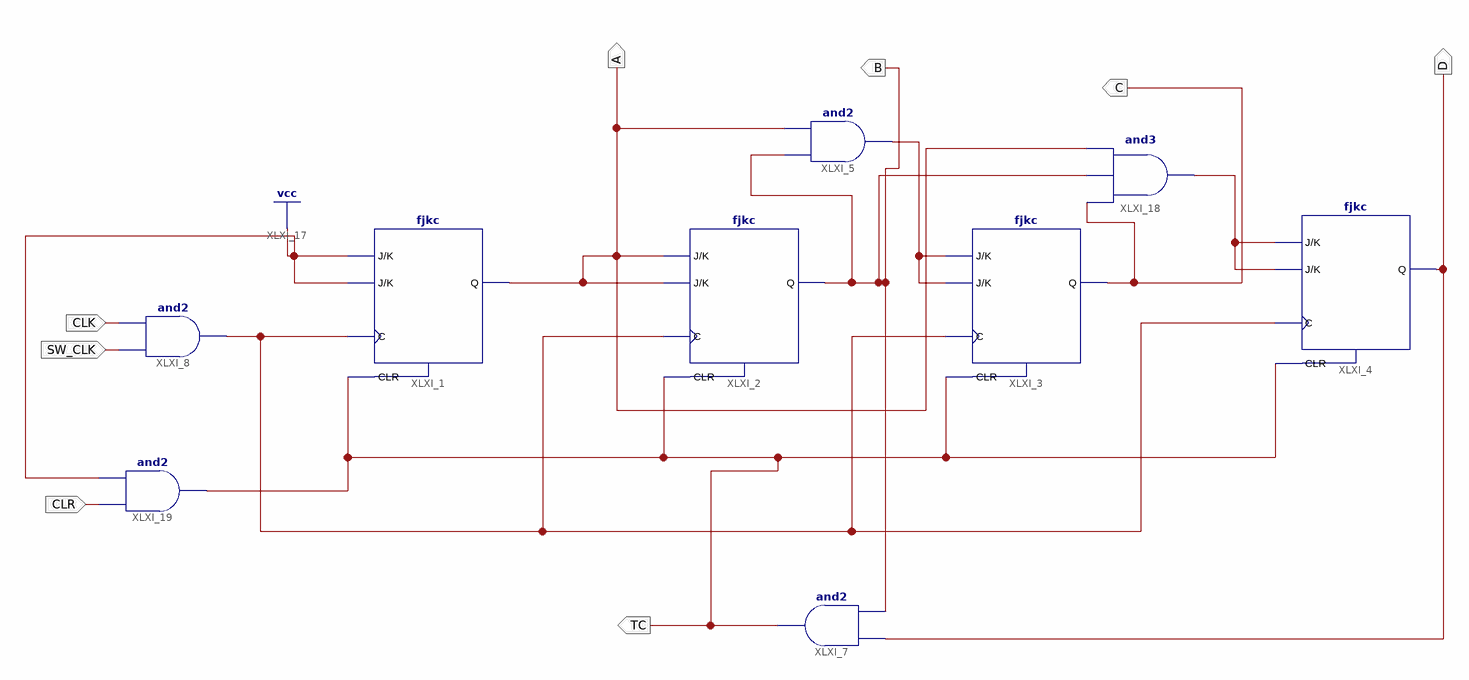
[diagram p0: schematic sheet 1]
// Xilinx ISE schematic SyncCounter0_9.sch (spartan6) as structural Verilog: 9 symbols, 8 ports
module SyncCounter0_9 (
  input  SW_CLK,
  input  CLK,
  input  CLR,
  output TC,
  output A,
  output C,
  output D,
  output B
);

  wire XLXN_5, XLXN_12, XLXN_34;

  fjkc XLXI_1 (.C(XLXN_5), .CLR(TC), .J(1'b1), .K(1'b1), .Q(A));
  fjkc XLXI_2 (.C(XLXN_5), .CLR(TC), .J(A), .K(A), .Q(B));
  fjkc XLXI_3 (.C(XLXN_5), .CLR(TC), .J(XLXN_12), .K(XLXN_12), .Q(C));
  and XLXI_5 (XLXN_12, B, A);
  fjkc XLXI_4 (.C(XLXN_5), .CLR(TC), .J(XLXN_34), .K(XLXN_34), .Q(D));
  and XLXI_7 (TC, B, D);
  and XLXI_8 (XLXN_5, SW_CLK, CLK);
  and XLXI_18 (XLXN_34, C, B, A);
  and XLXI_19 (TC, CLR, 1'b1);
endmodule
